# Altium schematic sheet Sheet2.SchDoc
size A4
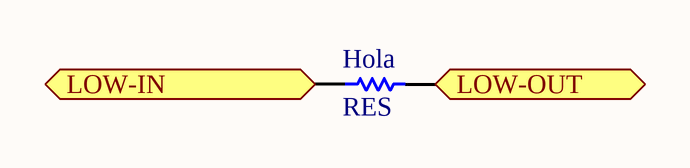
[diagram p0: Sheet2.SchDoc]

## Parts
Hola  RES  [RES400]

## Ports
LOW-IN (in), LOW-OUT (out)

## Nets
LOW-IN: Hola.1 ; port LOW-IN
LOW-OUT: Hola.2 ; port LOW-OUT